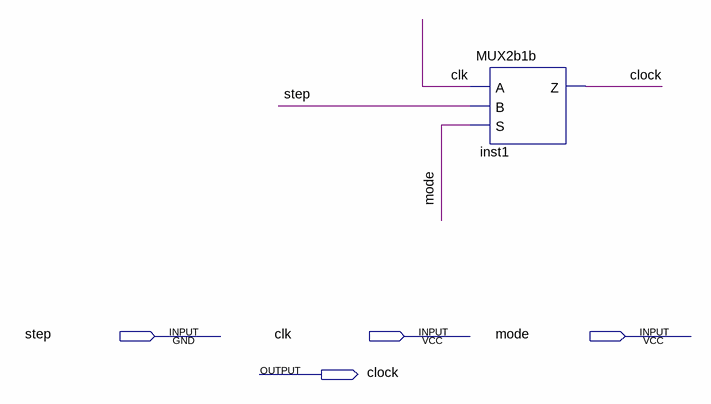
[diagram p0: schematic sheet]
// Quartus schematic runstep.bdf as structural Verilog: 1 symbols, 4 pins
module runstep (
  input  step,
  input  clk,
  input  mode,
  output clock
);

  MUX2b1b inst1 (.A(clk), .B(step), .S(mode), .Z(clock));
endmodule
